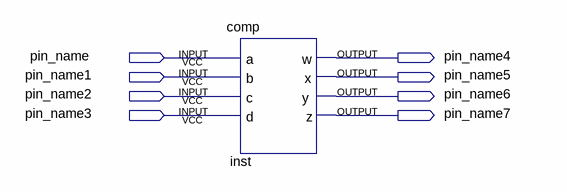
[diagram p0: schematic sheet]
// Quartus schematic complementer.bdf as structural Verilog: 1 symbols, 8 pins
module complementer (
  input  pin_name,
  input  pin_name1,
  input  pin_name2,
  input  pin_name3,
  output pin_name4,
  output pin_name5,
  output pin_name6,
  output pin_name7
);

  comp inst (
    .a(pin_name), .b(pin_name1), .c(pin_name2), .d(pin_name3), .w(pin_name4), .x(pin_name5), .y(pin_name6),
    .z(pin_name7));
endmodule
